# EAGLE board MainAutobike (EAGLE 7.3.0)
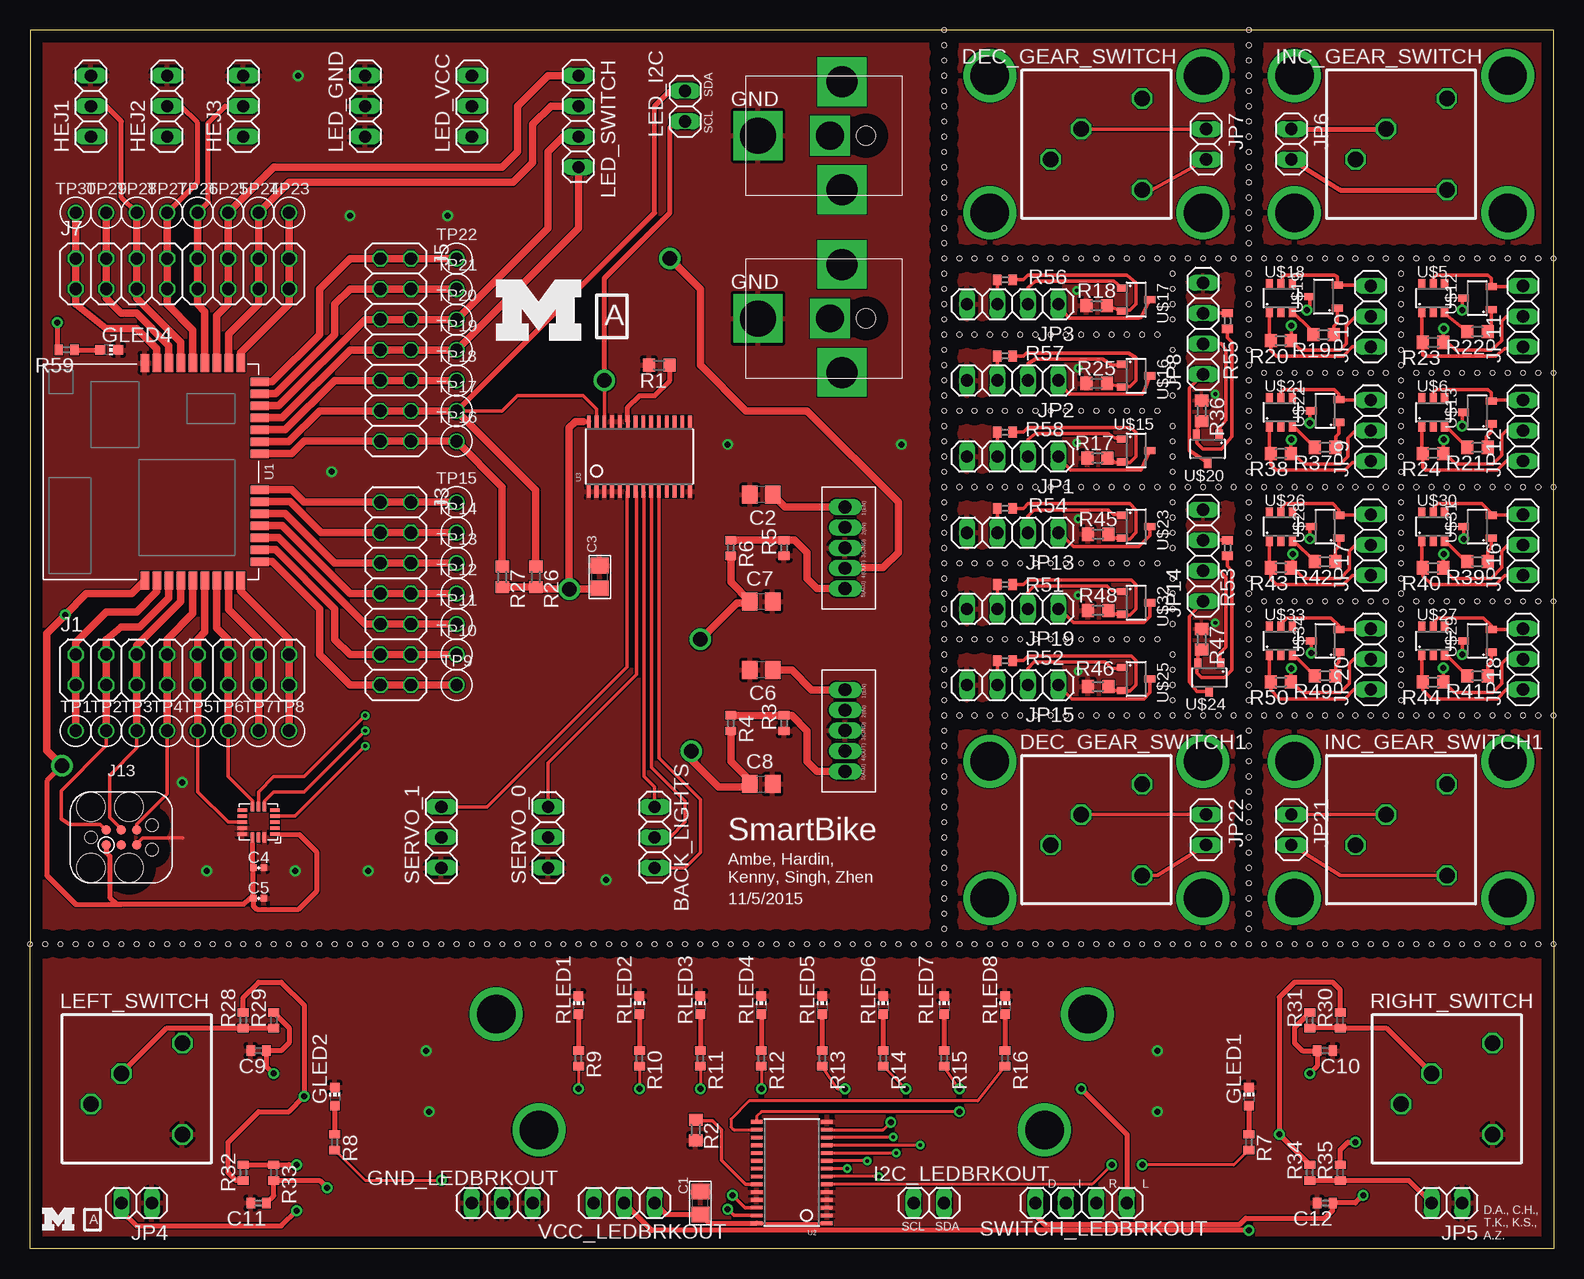
[diagram p6: board, top side]
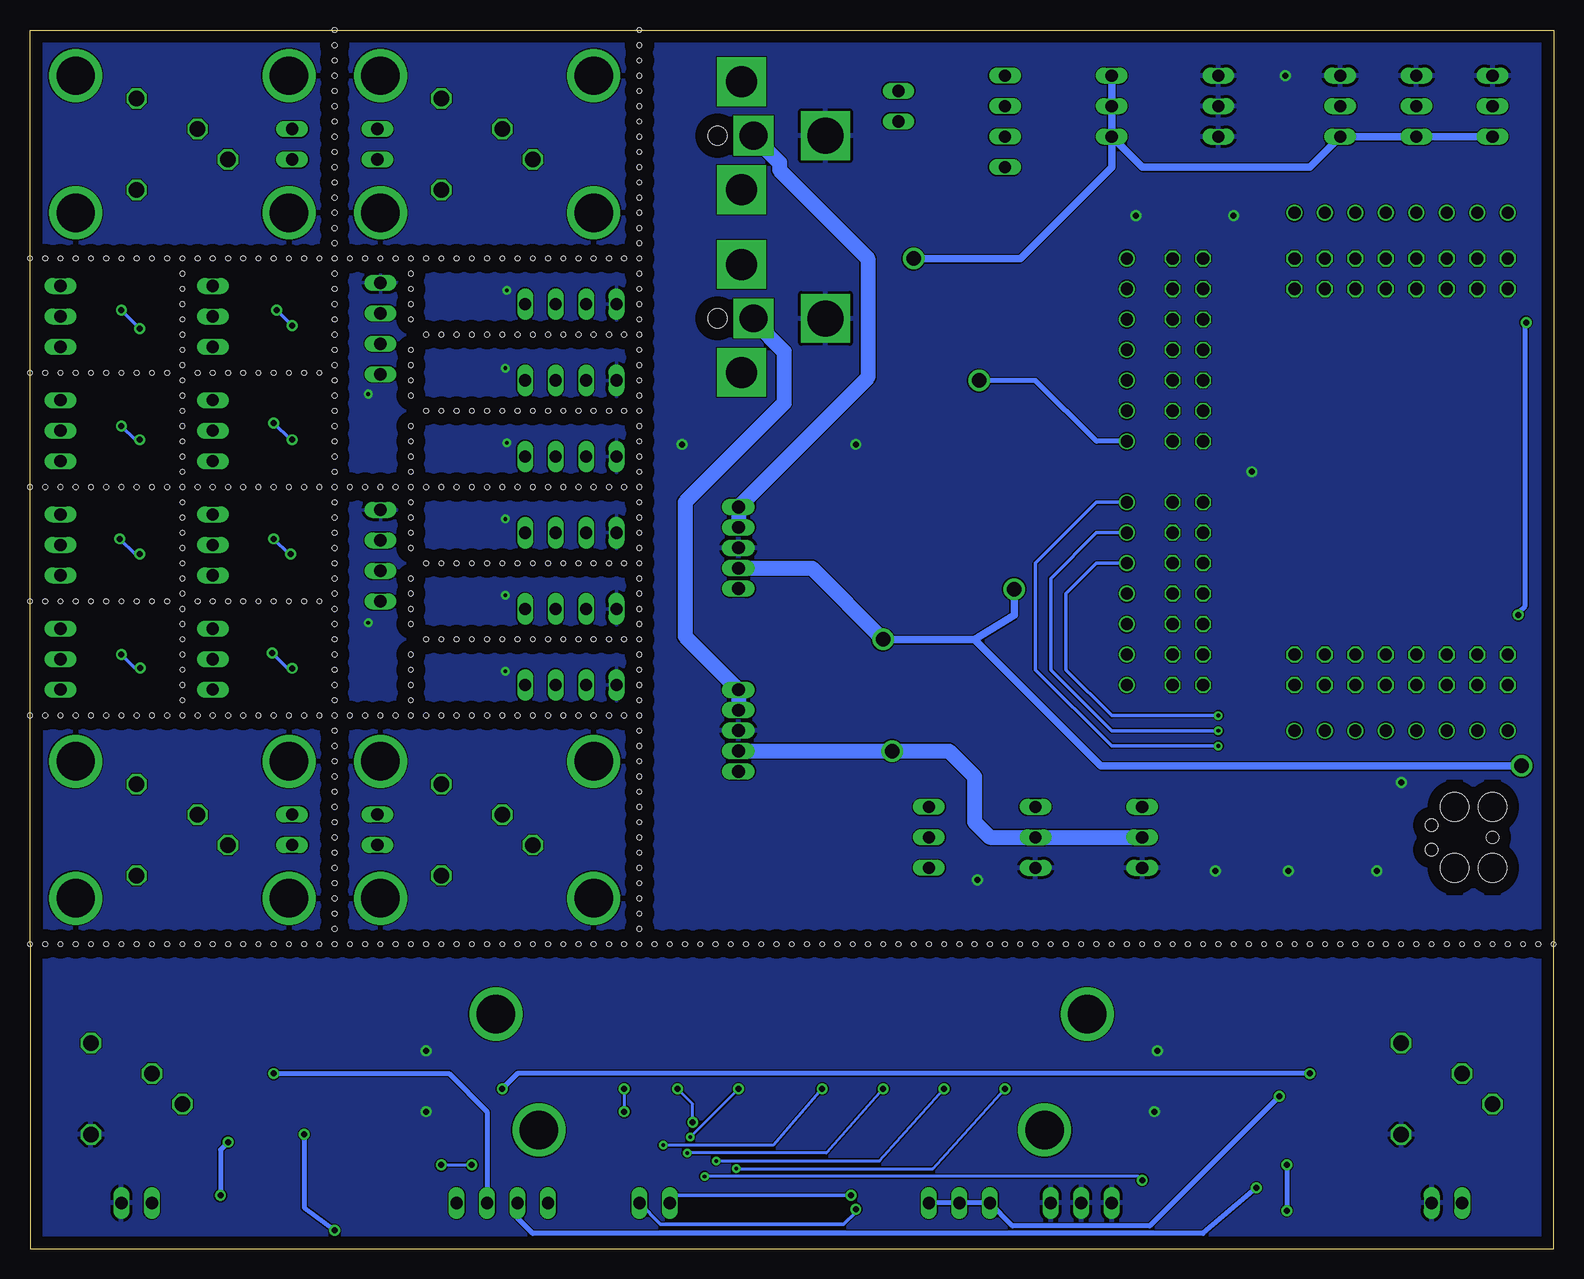
[diagram p7: board, bottom side, seen from below]

Size 127 x 101.6 mm. Coordinates in mm from the lower left corner, seen from the top.
Outline: 101.6,101.6 76.2,101.6 0,101.6 0,25.4 0,0 127,0 127,25.4 127,44.45 127,53.98 127,63.5 127,73.03 127,82.55 127,101.6 101.6,101.6
Copper layers (1*16): Top 0.035mm / dielectric 1.5mm / Bottom 0.035mm
Design rules "default *": minimum track width 4mil, minimum drill 12mil, track to track 4mil, track to pad 4mil, pad to pad 4mil, via to via 4mil, smd to smd 4mil, copper to edge 40mil, drill to drill 8mil, minimum pad ring 6mil, minimum via ring 8mil, stop-mask expansion 4mil, vias tented up to drill 0mil, thermal gap 10mil
Holes 0.38 mm at 0,25.4 1.27,25.4 2.54,25.4 3.81,25.4 5.08,25.4 6.35,25.4 7.62,25.4 8.89,25.4 10.16,25.4 11.43,25.4 12.7,25.4 13.97,25.4 15.24,25.4 16.51,25.4 17.78,25.4 19.05,25.4 20.32,25.4 21.59,25.4 22.86,25.4 24.13,25.4 25.4,25.4 26.67,25.4 27.94,25.4 29.21,25.4 30.48,25.4 31.75,25.4 33.02,25.4 34.29,25.4 35.56,25.4 36.83,25.4 38.1,25.4 39.37,25.4 40.64,25.4 41.91,25.4 43.18,25.4 44.45,25.4 45.72,25.4 46.99,25.4 48.26,25.4 49.53,25.4 50.8,25.4 52.07,25.4 53.34,25.4 54.61,25.4 55.88,25.4 57.15,25.4 58.42,25.4 59.69,25.4 60.96,25.4 62.23,25.4 63.5,25.4 64.77,25.4 66.04,25.4 67.31,25.4 68.58,25.4 69.85,25.4 71.12,25.4 72.39,25.4 73.66,25.4 74.93,25.4 76.2,25.4 77.47,25.4 78.74,25.4 80.01,25.4 81.28,25.4 82.55,25.4 83.82,25.4 85.09,25.4 86.36,25.4 87.63,25.4 88.9,25.4 90.17,25.4 91.44,25.4 92.71,25.4 93.98,25.4 95.25,25.4 96.52,25.4 97.79,25.4 99.06,25.4 100.33,25.4 101.6,25.4 102.87,25.4 104.14,25.4 105.41,25.4 106.68,25.4 107.95,25.4 109.22,25.4 110.49,25.4 111.76,25.4 113.03,25.4 114.3,25.4 115.57,25.4 116.84,25.4 118.11,25.4 119.38,25.4 120.65,25.4 121.92,25.4 123.19,25.4 124.46,25.4 125.73,25.4 127,25.4 76.2,101.6 76.2,100.33 76.2,99.06 76.2,97.79 76.2,96.52 76.2,95.25 76.2,93.98 76.2,92.71 76.2,91.44 76.2,90.17 76.2,88.9 76.2,87.63 76.2,86.36 76.2,85.09 76.2,83.82 76.2,82.55 76.2,81.28 76.2,80.01 76.2,78.74 76.2,77.47 76.2,76.2 76.2,74.93 76.2,73.66 76.2,72.39 76.2,71.12 76.2,69.85 76.2,68.58 76.2,67.31 76.2,66.04 76.2,64.77 76.2,63.5 76.2,62.23 76.2,60.96 76.2,59.69 76.2,58.42 76.2,57.15 76.2,55.88 76.2,54.61 76.2,53.34 76.2,52.07 76.2,50.8 76.2,49.53 76.2,48.26 76.2,46.99 76.2,45.72 76.2,44.45 76.2,43.18 76.2,41.91 76.2,40.64 76.2,39.37 76.2,38.1 76.2,36.83 76.2,35.56 76.2,34.29 76.2,33.02 76.2,31.75 76.2,30.48 76.2,29.21 76.2,27.94 76.2,26.67 101.6,101.6 101.6,100.33 101.6,99.06 101.6,97.79 101.6,96.52 101.6,95.25 101.6,93.98 101.6,92.71 101.6,91.44 101.6,90.17 101.6,88.9 101.6,87.63 101.6,86.36 101.6,85.09 101.6,83.82 101.6,81.28 101.6,80.01 101.6,78.74 101.6,77.47 101.6,76.2 101.6,74.93 101.6,73.66 101.6,72.39 101.6,71.12 101.6,69.85 101.6,68.58 101.6,67.31 101.6,66.04 101.6,64.77 101.6,63.5 101.6,62.23 101.6,60.96 101.6,59.69 101.6,58.42 101.6,57.15 101.6,55.88 101.6,54.61 101.6,53.34 101.6,52.07 101.6,50.8 101.6,49.53 101.6,48.26 101.6,46.99 101.6,45.72 101.6,44.45 101.6,43.18 101.6,41.91 101.6,40.64 101.6,39.37 101.6,38.1 101.6,36.83 101.6,35.56 101.6,34.29 101.6,33.02 101.6,31.75 101.6,30.48 101.6,29.21 101.6,27.94 101.6,26.67 77.47,44.45 78.74,44.45 80.01,44.45 81.28,44.45 82.55,44.45 83.82,44.45 85.09,44.45 86.36,44.45 87.63,44.45 88.9,44.45 90.17,44.45 91.44,44.45 92.71,44.45 93.98,44.45 95.25,44.45 96.52,44.45 97.79,44.45 99.06,44.45 100.33,44.45 102.87,44.45 104.14,44.45 105.41,44.45 106.68,44.45 107.95,44.45 109.22,44.45 110.49,44.45 111.76,44.45 113.03,44.45 114.3,44.45 115.57,44.45 116.84,44.45 118.11,44.45 119.38,44.45 120.65,44.45 121.92,44.45 123.19,44.45 124.46,44.45 125.73,44.45 77.47,63.5 78.74,63.5 80.01,63.5 81.28,63.5 82.55,63.5 83.82,63.5 85.09,63.5 86.36,63.5 87.63,63.5 88.9,63.5 90.17,63.5 91.44,63.5 92.71,63.5 93.98,63.5 95.25,63.5 96.52,63.5 97.79,63.5 99.06,63.5 100.33,63.5 102.87,63.5 104.14,63.5 105.41,63.5 106.68,63.5 107.95,63.5 109.22,63.5 110.49,63.5 111.76,63.5 113.03,63.5 114.3,63.5 115.57,63.5 116.84,63.5 118.11,63.5 119.38,63.5 120.65,63.5 121.92,63.5 123.19,63.5 124.46,63.5 125.73,63.5 101.6,82.55 77.47,82.55 78.74,82.55 80.01,82.55 81.28,82.55 82.55,82.55 83.82,82.55 85.09,82.55 86.36,82.55 87.63,82.55 88.9,82.55 90.17,82.55 91.44,82.55 92.71,82.55 93.98,82.55 95.25,82.55 96.52,82.55 97.79,82.55 99.06,82.55 100.33,82.55 102.87,82.55 104.14,82.55 105.41,82.55 106.68,82.55 107.95,82.55 109.22,82.55 110.49,82.55 111.76,82.55 113.03,82.55 114.3,82.55 115.57,82.55 116.84,82.55 118.11,82.55 119.38,82.55 120.65,82.55 121.92,82.55 123.19,82.55 124.46,82.55 125.73,82.55 77.47,69.85 78.74,69.85 80.01,69.85 81.28,69.85 82.55,69.85 83.82,69.85 85.09,69.85 86.36,69.85 87.63,69.85 88.9,69.85 90.17,69.85 91.44,69.85 92.71,69.85 93.98,69.85 95.25,67.31 95.25,66.04 95.25,64.77 95.25,71.12 95.25,72.39 95.25,73.66 95.25,74.93 95.25,68.58 93.98,76.2 95.25,77.47 95.25,78.74 95.25,80.01 95.25,81.28 77.47,76.2 78.74,76.2 80.01,76.2 81.28,76.2 82.55,76.2 83.82,76.2 85.09,76.2 86.36,76.2 87.63,76.2 88.9,76.2 90.17,76.2 91.44,76.2 92.71,76.2 102.87,73.03 104.14,73.03 105.41,73.03 106.68,73.03 107.95,73.03 109.22,73.03 110.49,73.03 111.76,73.03 113.03,73.03 114.3,81.28 114.3,80.01 114.3,78.74 114.3,77.47 114.3,76.2 114.3,74.93 114.3,73.66 115.57,73.03 116.84,73.03 118.11,73.03 119.38,73.03 120.65,73.03 121.92,73.03 123.19,73.03 124.46,73.03 125.73,73.03 114.3,72.39 114.3,71.12 114.3,69.85 114.3,68.58 114.3,67.31 114.3,66.04 114.3,64.77 114.3,62.23 114.3,60.96 114.3,59.69 114.3,58.42 114.3,57.15 114.3,55.88 114.3,54.61 114.3,53.34 114.3,52.07 114.3,50.8 114.3,49.53 114.3,48.26 114.3,46.99 114.3,45.72 102.87,53.98 104.14,53.98 105.41,53.98 106.68,53.98 107.95,53.98 109.22,53.98 110.49,53.98 111.76,53.98 113.03,53.98 115.57,53.98 116.84,53.98 118.11,53.98 119.38,53.98 120.65,53.98 121.92,53.98 123.19,53.98 124.46,53.98 125.73,53.98 95.25,48.26 95.25,46.99 95.25,45.72 95.25,52.07 95.25,53.34 95.25,54.61 95.25,55.88 95.25,49.53 95.25,58.42 95.25,59.69 95.25,60.96 95.25,62.23 77.47,57.15 78.74,57.15 80.01,57.15 81.28,57.15 82.55,57.15 83.82,57.15 85.09,57.15 86.36,57.15 87.63,57.15 88.9,57.15 90.17,57.15 91.44,57.15 92.71,57.15 93.98,57.15 77.47,50.8 78.74,50.8 80.01,50.8 81.28,50.8 82.55,50.8 83.82,50.8 85.09,50.8 86.36,50.8 87.63,50.8 88.9,50.8 90.17,50.8 91.44,50.8 92.71,50.8 93.98,50.8 127,82.55 127,73.03 127,63.5 127,53.98 127,44.45

## Footprints (pad centres in the part's own frame; a part is rotated, then mirrored left to right if it is on the bottom)
1X03 = drill 1.016 long: 1 -2.54,0; 2 0,0; 3 2.54,0
0805 = smd 1.3 x 1.5: 1 -0.95,0; 2 0.95,0
C0805 = smd 1.3 x 1.5: 1 -0.95,0; 2 0.95,0
0402_CAP = smd 0.536 x 0.546: 1 -0.433,0; 2 0.433,0
C0402 = smd 0.7 x 0.9: 1 -0.65,0; 2 0.65,0
LED_SWITCH = drill 1.3 octagon: P$1 -3.81,-1.27; P$2 -1.27,1.27; P$3 3.81,3.81; P$4 3.81,-3.81
CHIP-LED0603 = smd 0.8 x 0.8: A 0,-0.75; C 0,0.75
1X02 = drill 1.016 long: 1 -1.27,0; 2 1.27,0
2X08 = drill 1.016 octagon: 1 -8.89,-1.27; 2 -8.89,1.27; 3 -6.35,-1.27; 4 -6.35,1.27; 5 -3.81,-1.27; 6 -3.81,1.27; 7 -1.27,-1.27; 8 -1.27,1.27; 9 1.27,-1.27; 10 1.27,1.27; 11 3.81,-1.27; 12 3.81,1.27; 13 6.35,-1.27; 14 6.35,1.27; 15 8.89,-1.27; 16 8.89,1.27
2X07 = drill 1.016 octagon: 1 -7.62,-1.27; 2 -7.62,1.27; 3 -5.08,-1.27; 4 -5.08,1.27; 5 -2.54,-1.27; 6 -2.54,1.27; 7 0,-1.27; 8 0,1.27; 9 2.54,-1.27; 10 2.54,1.27; 11 5.08,-1.27; 12 5.08,1.27; 13 7.62,-1.27; 14 7.62,1.27
TC2030-IDC = smd 0.787 x 0.787: 1 -1.27,-0.635; 2 -1.27,0.635; 3 0,-0.635; 4 0,0.635; 5 1.27,-0.635; 6 1.27,0.635 | hole 2.375: -2.54,2.54; 0.635,2.54; 0.635,-2.54; -2.54,-2.54 | hole 1.016: -2.54,0; 2.54,1.016; 2.54,-1.016
1X04 = drill 1.016 long: 1 -3.81,0; 2 -1.27,0; 3 1.27,0; 4 3.81,0
R0603 = smd 1 x 1.1: 1 -0.85,0; 2 0.85,0
R0402 = smd 0.7 x 0.9: 1 -0.65,0; 2 0.65,0
TESTPOINT_0.040IN = drill 1.016: TESTPOINT 0,0
ATUM = smd 0.7 x 1.5: 1 -9.479,-9.079; 2 -8.479,-9.079; 3 -7.479,-9.079; 4 -6.479,-9.079; 5 -5.479,-9.079; 6 -4.479,-9.079; 7 -3.479,-9.079; 8 -2.479,-9.079; 24 -1.479,9.079; 25 -2.479,9.079; 26 -3.479,9.079; 27 -4.479,9.079; 28 -5.479,9.079; 29 -6.479,9.079; 30 -7.479,9.079; 31 -8.479,9.079; 32 -9.479,9.079 | smd 0.754 x 1.5: 9 -1.479,-9.079 | smd 1.5 x 0.7: 10 0.1,-7.5; 11 0.1,-6.5; 12 0.1,-5.5; 13 0.1,-4.5; 14 0.1,-3.5; 15 0.1,-2.5; 16 0.1,-1.5; 17 0.1,1.5; 18 0.1,2.5; 19 0.1,3.5; 20 0.1,4.5; 21 0.1,5.5; 22 0.1,6.5; 23 0.1,7.5
TSSOP28 = smd 0.305 x 0.991: 1 -4.225,-2.918; 2 -3.575,-2.918; 3 -2.925,-2.918; 4 -2.275,-2.918; 5 -1.625,-2.918; 6 -0.975,-2.918; 7 -0.325,-2.918; 8 0.325,-2.918; 9 0.975,-2.918; 10 1.625,-2.918; 11 2.275,-2.918; 12 2.925,-2.918; 13 3.575,-2.918; 14 4.225,-2.918; 15 4.225,2.918; 16 3.575,2.918; 17 2.925,2.918; 18 2.275,2.918; 19 1.625,2.918; 20 0.975,2.918; 21 0.325,2.918; 22 -0.325,2.918; 23 -0.975,2.918; 24 -1.625,2.918; 25 -2.275,2.918; 26 -2.925,2.918; 27 -3.575,2.918; 28 -4.225,2.918
ADXL362 = smd 0.8 x 0.3: P$1 -1.35,1; P$2 -1.35,0.5; P$3 -1.35,0; P$4 -1.35,-0.5; P$5 -1.35,-1; P$9 1.35,-1; P$10 1.35,-0.5; P$11 1.35,0; P$12 1.35,0.5; P$13 1.35,1 | smd 0.3 x 0.8: P$6 -0.5,-1.275; P$7 0,-1.275; P$8 0.5,-1.275; P$14 0.5,1.275; P$15 0,1.275; P$16 -0.5,1.275
MIC29710 = drill 1.067 pad 1.27 long: 1(EN) 1.664,1.905; 2(IN) 3.365,1.905; 3(GND) 5.067,1.905; 4(OUT) 6.769,1.905; 5(ADJ) 8.471,1.905
SOT23-6 = smd 0.6 x 0.9: 1 -0.95,-1.15; 2 0,-1.15; 3 0.95,-1.15; 4 0.95,1.15; 5 0,1.15; 6 -0.95,1.15
PJ063BH = drill 2.6 pad 4.064 square: FRAME0 0.5,8; FRAME1 9.5,8 | drill 3 pad 4.064 square: GND 5,1 | drill 2.3 pad 3.302 square: VDD 5,7 | hole 1.6: 5,10
SOT23-3 = smd 0.6 x 0.9: 1 -0.95,-1.15; 2 0.95,-1.15; 3 0,1.15

## Placement (x,y rotation side)
BACK_LIGHTS  [1X03]  52.07,34.29 270 top
C1  10uF  [0805]  55.88,3.81 90 top
C2  10uF  [C0805]  60.96,62.87 180 top
C3  10uF  [0805]  47.5,56.01 90 top
C4  100nF  [0402_CAP]  19.05,31.75 0 top
C5  100nF  [0402_CAP]  19.05,29.21 0 top
C6  10uF  [C0805]  60.96,48.26 180 top
C7  33uF  [C0805]  60.96,53.98 0 top
C8  33uF  [C0805]  60.96,38.73 0 top
C9  [C0402]  19.05,16.51 180 top
C10  [C0402]  107.95,16.51 0 top
C11  [C0402]  19.05,3.81 180 top
C12  [C0402]  107.95,3.81 180 top
DEC_GEAR_SWITCH  LED_SWITCH  [LED_SWITCH]  88.9,92.08 0 top
DEC_GEAR_SWITCH1  LED_SWITCH  [LED_SWITCH]  88.9,34.92 0 top
GLED1  [CHIP-LED0603]  101.6,12.7 0 top
GLED2  [CHIP-LED0603]  25.4,12.7 0 top
GLED4  [CHIP-LED0603]  6.6,74.93 270 top
GND_LEDBRKOUT  [1X03]  39.37,3.81 0 top
HEJ1  [1X03]  5.08,95.25 90 top
HEJ2  [1X03]  11.43,95.25 90 top
HEJ3  [1X03]  17.78,95.25 90 top
I2C_LEDBRKOUT  [1X02]  74.93,3.81 0 top
INC_GEAR_SWITCH  LED_SWITCH  [LED_SWITCH]  114.3,92.08 0 top
INC_GEAR_SWITCH1  LED_SWITCH  [LED_SWITCH]  114.3,34.92 0 top
J1  [2X08]  12.7,48.26 0 top
J3  [2X07]  30.48,54.61 270 top
J5  [2X07]  30.48,74.93 270 top
J7  [2X08]  12.7,81.28 0 top
J13  TC2030-CTX  [TC2030-IDC]  7.62,34.29 0 top
JP1  [1X04]  81.91,66.04 180 top
JP2  [1X04]  81.91,72.39 180 top
JP3  [1X04]  81.91,78.74 180 top
JP4  [1X02]  8.89,3.81 180 top
JP5  [1X02]  118.11,3.81 180 top
JP6  [1X02]  105.16,92.08 270 top
JP7  [1X02]  98.04,92.08 270 top
JP8  [1X04]  97.79,76.71 90 top
JP9  [1X03]  111.76,68.2 90 top
JP10  [1X03]  111.76,77.72 90 top
JP11  [1X03]  124.46,77.72 90 top
JP12  [1X03]  124.46,68.2 90 top
JP13  [1X04]  81.91,59.69 180 top
JP14  [1X04]  97.79,57.78 90 top
JP15  [1X04]  81.91,46.99 180 top
JP16  [1X03]  124.46,58.67 90 top
JP17  [1X03]  111.76,58.67 90 top
JP18  [1X03]  124.46,49.15 90 top
JP19  [1X04]  81.91,53.34 180 top
JP20  [1X03]  111.76,49.15 90 top
JP21  [1X02]  105.16,34.92 270 top
JP22  [1X02]  98.04,34.92 270 top
LED_GND  [1X03]  27.94,95.25 90 top
LED_I2C  [1X02]  54.61,95.25 90 top
LED_SWITCH  [1X04]  45.72,93.98 270 top
LED_VCC  [1X03]  36.83,95.25 90 top
LEFT_SWITCH  LED_SWITCH  [LED_SWITCH]  8.89,13.34 0 top
R1  10K  [R0603]  52.45,73.66 180 top
R2  10K  [R0603]  55.5,9.91 270 top
R3  26.1k  [R0402]  62.87,43.81 90 top
R4  100k  [R0402]  58.42,43.81 270 top
R5  60.4k  [R0402]  62.87,58.42 90 top
R6  100k  [R0402]  58.42,58.42 270 top
R7  60.4  [R0402]  101.6,8.89 270 top
R8  60.4  [R0402]  25.4,8.89 270 top
R9  261  [R0402]  45.72,15.88 270 top
R10  261  [R0402]  50.8,15.88 270 top
R11  261  [R0402]  55.88,15.88 270 top
R12  261  [R0402]  60.96,15.88 270 top
R13  261  [R0402]  66.04,15.88 270 top
R14  261  [R0402]  71.12,15.88 270 top
R15  261  [R0402]  76.2,15.88 270 top
R16  261  [R0402]  81.28,15.88 270 top
R17  10k  [R0603]  88.98,65.91 0 top
R18  10k  [R0603]  88.9,78.61 0 top
R19  1k  [R0603]  107.82,76.2 180 top
R20  390  [R0603]  104.27,75.69 180 top
R21  1k  [R0603]  120.65,66.8 180 top
R22  1k  [R0603]  120.65,76.45 180 top
R23  390  [R0603]  116.97,75.56 180 top
R24  390  [R0603]  116.97,66.29 180 top
R25  10k  [R0603]  88.9,72.14 0 top
R26  10k  [R0603]  42.16,56.01 270 top
R27  10k  [R0603]  39.37,56.01 270 top
R28  [R0402]  17.78,19.05 90 top
R29  [R0402]  20.32,19.05 90 top
R30  [R0402]  109.22,19.05 90 top
R31  [R0402]  106.68,19.05 90 top
R32  [R0402]  17.78,6.35 270 top
R33  [R0402]  20.32,6.35 270 top
R34  [R0402]  106.68,6.35 90 top
R35  [R0402]  109.22,6.35 90 top
R36  10k  [R0603]  97.66,69.85 270 top
R37  1k  [R0603]  107.95,66.8 180 top
R38  390  [R0603]  104.27,66.29 180 top
R39  1k  [R0603]  120.65,57.28 180 top
R40  390  [R0603]  116.97,56.77 180 top
R41  1k  [R0603]  120.65,47.75 180 top
R42  1k  [R0603]  107.95,57.28 180 top
R43  390  [R0603]  104.27,56.77 180 top
R44  390  [R0603]  116.97,47.24 180 top
R45  10k  [R0603]  89.03,59.56 0 top
R46  10k  [R0603]  89.03,46.86 0 top
R47  10k  [R0603]  97.66,50.8 270 top
R48  10k  [R0603]  89.03,53.21 0 top
R49  1k  [R0603]  107.95,47.75 180 top
R50  390  [R0603]  104.27,47.24 180 top
R51  33  [R0402]  81.28,55.37 0 top
R52  33  [R0402]  81.28,49.02 0 top
R53  33  [R0402]  99.82,58.42 270 top
R54  33  [R0402]  81.28,61.72 0 top
R55  33  [R0402]  99.82,77.34 270 top
R56  33  [R0402]  81.28,80.77 0 top
R57  33  [R0402]  81.28,74.42 0 top
R58  33  [R0402]  81.28,68.07 0 top
R59  60.4  [R0402]  3.05,74.93 180 top
RIGHT_SWITCH  LED_SWITCH  [LED_SWITCH]  118.11,13.34 0 top
RLED1  [CHIP-LED0603]  45.72,20.32 0 top
RLED2  [CHIP-LED0603]  50.8,20.32 0 top
RLED3  [CHIP-LED0603]  55.88,20.32 0 top
RLED4  [CHIP-LED0603]  60.96,20.32 0 top
RLED5  [CHIP-LED0603]  66.04,20.32 0 top
RLED6  [CHIP-LED0603]  71.12,20.32 0 top
RLED7  [CHIP-LED0603]  76.2,20.32 0 top
RLED8  [CHIP-LED0603]  81.28,20.32 0 top
SERVO_0  [1X03]  43.18,34.29 90 top
SERVO_1  [1X03]  34.29,34.29 90 top
SWITCH_LEDBRKOUT  [1X04]  87.63,3.81 0 top
TP1  TEST_POINT_0.040IN  [TESTPOINT_0.040IN]  3.81,43.18 0 top
TP2  TEST_POINT_0.040IN  [TESTPOINT_0.040IN]  6.35,43.18 0 top
TP3  TEST_POINT_0.040IN  [TESTPOINT_0.040IN]  8.89,43.18 0 top
TP4  TEST_POINT_0.040IN  [TESTPOINT_0.040IN]  11.43,43.18 0 top
TP5  TEST_POINT_0.040IN  [TESTPOINT_0.040IN]  13.97,43.18 0 top
TP6  TEST_POINT_0.040IN  [TESTPOINT_0.040IN]  16.51,43.18 0 top
TP7  TEST_POINT_0.040IN  [TESTPOINT_0.040IN]  19.05,43.18 0 top
TP8  TEST_POINT_0.040IN  [TESTPOINT_0.040IN]  21.59,43.18 0 top
TP9  TEST_POINT_0.040IN  [TESTPOINT_0.040IN]  35.56,46.99 0 top
TP10  TEST_POINT_0.040IN  [TESTPOINT_0.040IN]  35.56,49.53 0 top
TP11  TEST_POINT_0.040IN  [TESTPOINT_0.040IN]  35.56,52.07 0 top
TP12  TEST_POINT_0.040IN  [TESTPOINT_0.040IN]  35.56,54.61 0 top
TP13  TEST_POINT_0.040IN  [TESTPOINT_0.040IN]  35.56,57.15 0 top
TP14  TEST_POINT_0.040IN  [TESTPOINT_0.040IN]  35.56,59.69 0 top
TP15  TEST_POINT_0.040IN  [TESTPOINT_0.040IN]  35.56,62.23 0 top
TP16  TEST_POINT_0.040IN  [TESTPOINT_0.040IN]  35.56,67.31 0 top
TP17  TEST_POINT_0.040IN  [TESTPOINT_0.040IN]  35.56,69.85 0 top
TP18  TEST_POINT_0.040IN  [TESTPOINT_0.040IN]  35.56,72.39 0 top
TP19  TEST_POINT_0.040IN  [TESTPOINT_0.040IN]  35.56,74.93 0 top
TP20  TEST_POINT_0.040IN  [TESTPOINT_0.040IN]  35.56,77.47 0 top
TP21  TEST_POINT_0.040IN  [TESTPOINT_0.040IN]  35.56,80.01 0 top
TP22  TEST_POINT_0.040IN  [TESTPOINT_0.040IN]  35.56,82.55 0 top
TP23  TEST_POINT_0.040IN  [TESTPOINT_0.040IN]  21.59,86.36 0 top
TP24  TEST_POINT_0.040IN  [TESTPOINT_0.040IN]  19.05,86.36 0 top
TP25  TEST_POINT_0.040IN  [TESTPOINT_0.040IN]  16.51,86.36 0 top
TP26  TEST_POINT_0.040IN  [TESTPOINT_0.040IN]  13.97,86.36 0 top
TP27  TEST_POINT_0.040IN  [TESTPOINT_0.040IN]  11.43,86.36 0 top
TP28  TEST_POINT_0.040IN  [TESTPOINT_0.040IN]  8.89,86.36 0 top
TP29  TEST_POINT_0.040IN  [TESTPOINT_0.040IN]  6.35,86.36 0 top
TP30  TEST_POINT_0.040IN  [TESTPOINT_0.040IN]  3.81,86.36 0 top
U1  ATUM  [ATUM]  19.05,64.77 0 top
U2  PCA9685  [TSSOP28]  63.5,6.35 90 top
U3  PCA9685  [TSSOP28]  50.8,66.04 0 top
U4  ADXL362  [ADXL362]  19.05,35.56 180 top
U$1  [UMICH_SOLID_200MIL]  38.86,75.69 0 top
U$2  MIC29710  [MIC29710]  66.04,63.5 270 top
U$3  [UMICH_SOLID_75MIL]  1.02,1.52 0 top
U$4  MIC29710  [MIC29710]  66.04,48.26 270 top
U$5  HALLEFFECT  [SOT23-6]  116.97,79.25 0 top
U$6  HALLEFFECT  [SOT23-6]  116.97,69.72 0 top
U$11  PJ063PH  [PJ063BH]  59.69,97.79 270 top
U$12  25AA02E48-SOT-23-6  [SOT23-3]  120.65,79.25 90 top
U$13  25AA02E48-SOT-23-6  [SOT23-3]  120.65,69.72 90 top
U$14  PJ063PH  [PJ063BH]  59.69,82.55 270 top
U$15  25AA02E48-SOT-23-6  [SOT23-3]  92.2,66.55 270 top
U$16  25AA02E48-SOT-23-6  [SOT23-3]  92.2,72.77 270 top
U$17  25AA02E48-SOT-23-6  [SOT23-3]  92.2,79.12 270 top
U$18  HALLEFFECT  [SOT23-6]  104.27,79.25 0 top
U$19  25AA02E48-SOT-23-6  [SOT23-3]  107.82,79.38 90 top
U$20  25AA02E48-SOT-23-6  [SOT23-3]  98.17,66.67 180 top
U$21  HALLEFFECT  [SOT23-6]  104.27,69.72 0 top
U$22  25AA02E48-SOT-23-6  [SOT23-3]  107.95,69.85 90 top
U$23  25AA02E48-SOT-23-6  [SOT23-3]  92.2,60.2 270 top
U$24  25AA02E48-SOT-23-6  [SOT23-3]  98.3,47.62 180 top
U$25  25AA02E48-SOT-23-6  [SOT23-3]  92.2,47.5 270 top
U$26  HALLEFFECT  [SOT23-6]  104.27,60.2 0 top
U$27  HALLEFFECT  [SOT23-6]  116.97,50.67 0 top
U$28  25AA02E48-SOT-23-6  [SOT23-3]  107.95,60.2 90 top
U$29  25AA02E48-SOT-23-6  [SOT23-3]  120.65,50.67 90 top
U$30  HALLEFFECT  [SOT23-6]  116.97,60.2 0 top
U$31  25AA02E48-SOT-23-6  [SOT23-3]  120.65,60.2 90 top
U$32  25AA02E48-SOT-23-6  [SOT23-3]  92.2,53.85 270 top
U$33  HALLEFFECT  [SOT23-6]  104.27,50.67 0 top
U$34  25AA02E48-SOT-23-6  [SOT23-3]  107.95,50.67 90 top
VCC_LEDBRKOUT  [1X03]  49.53,3.81 0 top

## Tracks (layer width: path | path; a pad name or v marks a point on that pad's centre or on a via)
19
  Top 0.406: R29.1 R28.1 11.41,18.4 LEFT_SWITCH.P$2
20
  Top 0.406: R31.1 R30.1 113.05,18.4 RIGHT_SWITCH.P$2
21  (via drill 0.5)
  Top 0.406: JP4.2 7.62,3.17 8.89,1.91 20.95,1.91 v22.23,3.17 | R32.1 R33.1 21.58,7 v22.23,6.98
  Bottom 0.406: v22.23,6.98 v22.23,3.17
22
  Top 0.406: JP5.2 114.95,5.7 R35.1 109.2,5.72 106.68,5.72 R34.1
!RESET
  Top 0.61: TP29.TESTPOINT J7.4 J7.3 6.35,79.25 7.62,77.98 8.89,77.98 11.57,75.3 U1.30
AIN3
  Top 0.61: LED_SWITCH.2 43.43,95.25 41.91,93.73 41.91,90.55 40.26,88.9 21.59,88.9 TP24.TESTPOINT J7.14 J7.13 19.05,78.74 16.57,76.26 U1.25
AIN4
  Top 0.61: LED_SWITCH.1 43.18,97.79 40.64,95.25 40.64,91.44 39.37,90.17 20.32,90.17 TP25.TESTPOINT J7.12 J7.11 16.51,78.74 15.57,77.8 U1.26
AIN5
  Top 0.406: TP26.TESTPOINT 14.86,87.25 14.86,93.85 16.26,95.25 HEJ3.2
  Top 0.61: U1.27 14.57,78.14 13.97,78.74 J7.9 J7.10 TP26.TESTPOINT
AIN6
  Top 0.406: HEJ2.2 12.57,95.25 13.97,93.85 13.97,88.9 TP27.TESTPOINT
  Top 0.61: U1.28 13.57,76.6 11.43,78.74 J7.7 J7.8 TP27.TESTPOINT
AIN7
  Top 0.406: TP28.TESTPOINT 7.62,87.63 7.62,93.98 6.35,95.25 HEJ1.2
  Top 0.61: U1.29 12.57,75.57 8.89,79.25 J7.5 J7.6 TP28.TESTPOINT
BATTERY
  Top 0.61: U1.31 10.57,75.03 8.89,76.71 6.35,76.71 3.81,78.74 J7.1 J7.2 TP30.TESTPOINT
BOOTLOADER_CTRL
  Top 0.61: U1.24 17.57,74.72 21.59,78.74 J7.15 J7.16 TP23.TESTPOINT
BOOTLOADER_RX
  Top 0.61: U1.22 20.47,71.27 25.4,76.2 25.4,78.74 26.67,80.01 J5.3 J5.4 TP21.TESTPOINT
BOOTLOADER_TX
  Top 0.61: U1.23 20.2,72.27 24.13,76.2 24.13,80.01 26.67,82.55 J5.1 J5.2 TP22.TESTPOINT
DEC_GEAR_SWITCH_OUT  (via drill 0.5)
  Top 0.406: R35.2 109.22,8.26 109.85,8.89 v110.49,8.89 | v111.12,4.45 110.49,3.81 C12.1 108.6,3.19 107.95,2.54 101.35,2.54 100.84,2.03 84.58,2.03 83.82,2.79 SWITCH_LEDBRKOUT.1
  Bottom 0.406: v110.49,8.89 111.12,8.26 v111.12,4.45
DGND_USB
  Top 0.61: U1.10 20.2,57.27 24.13,53.34 24.13,49.53 26.67,46.99 J3.13 J3.14 TP9.TESTPOINT
DVDD_USB
  Top 0.61: U1.13 21.01,60.27 26.67,54.61 J3.7 J3.8 TP12.TESTPOINT
GND  (via drill 0.5)
  Top 0.305: J13.5 8.89,33.76 9.4,34.27 12.73,34.27
  other vias: 12.7,38.86 14.73,31.5 28.19,31.5 48.01,30.73 58.17,67.06 72.64,67.06 26.67,86.11 34.8,86.11 22.35,97.79 25.15,64.77 22.1,31.5
  pour Bottom: 0,101.6 74.93,101.6 74.93,26.67 0,26.67
  pour Top: 0,101.6 74.93,101.6 74.93,26.67 0,26.67
GND_LEDBRKOUT  (via drill 0.5)
  other vias: 33.02,16.51 33.27,11.43 93.98,16.51 93.98,11.43
  pour Bottom: 0,24.13 127,24.13 127,0 0,0
  pour Top: 0,24.13 127,24.13 127,0 0,0
GND_LGT1  (via drill 0.3)
  other vias: 87.25,67.18
  pour Top: 76.71,69.34 94.49,69.34 94.49,64.14 76.71,64.14
  pour Bottom: 76.71,69.34 94.49,69.34 94.49,64.14 76.71,64.14
GND_LGT2  (via drill 0.3)
  other vias: 87.38,73.41
  pour Bottom: 76.71,75.56 94.49,75.56 94.49,70.36 76.71,70.36
  pour Top: 76.71,75.56 94.49,75.56 94.49,70.36 76.71,70.36
GND_LGT3  (via drill 0.3)
  other vias: 87.25,79.88
  pour Bottom: 76.71,81.91 94.49,81.91 94.49,76.96 76.71,76.96
  pour Top: 76.71,81.91 94.49,81.91 94.49,76.96 76.71,76.96
GND_LGT4  (via drill 0.3)
  other vias: 98.81,71.25
  pour Bottom: 95.63,82.17 100.97,82.17 100.97,64.26 95.63,64.26
  pour Top: 95.63,82.17 100.97,82.17 100.97,64.26 95.63,64.26
GND_LGT5  (via drill 0.3)
  other vias: 87.38,60.83
  pour Top: 76.71,62.99 94.49,62.99 94.49,57.78 76.71,57.78
  pour Bottom: 76.71,62.99 94.49,62.99 94.49,57.78 76.71,57.78
GND_LGT6  (via drill 0.3)
  other vias: 98.81,52.2
  pour Bottom: 95.63,62.87 100.97,62.87 100.97,44.96 95.63,44.96
  pour Top: 95.63,62.87 100.97,62.87 100.97,44.96 95.63,44.96
GND_LGT7  (via drill 0.3)
  other vias: 87.38,48.13
  pour Top: 76.71,50.29 94.49,50.29 94.49,45.09 76.71,45.09
  pour Bottom: 76.71,50.29 94.49,50.29 94.49,45.09 76.71,45.09
GND_LGT8  (via drill 0.3)
  other vias: 87.38,54.48
  pour Top: 76.71,56.64 94.49,56.64 94.49,51.44 76.71,51.44
  pour Bottom: 76.71,56.64 94.49,56.64 94.49,51.44 76.71,51.44
HE1GND
  Top 0.305: JP10.3 111.7,80.33 U$19.2 108.97,81.02 108.71,81.15 104.65,81.15 104.39,81.03 104.39,80.53 U$18.5
HE1OUT  (via drill 0.5)
  Top 0.305: JP10.2 110.49,77.72 109.73,76.96 109.73,75.44 109.22,74.93 105.92,74.93 105.16,75.69 R20.1 105.16,75.73 v105.16,76.96 | U$19.3 106.67,78.48 v106.43,78.23
  Bottom 0.305: v106.43,78.23 v105.16,76.96
HE1VIN
  Top 0.305: U$18.1 103.32,75.79 R20.2 103.42,74.89 103.89,74.42 109.47,74.42 110.24,75.18 JP10.1
HE2GND
  Top 0.305: U$5.5 116.97,80.9 117.22,81.15 121.54,81.15 121.79,80.9 U$12.2 124.39,80.2 JP11.3
HE2OUT  (via drill 0.5)
  Top 0.305: JP11.2 123.06,77.72 122.68,77.34 122.68,75.69 121.79,74.93 118.87,74.93 118.11,75.56 R23.1 117.82,76.67 v117.86,76.71 | v119.38,78.23 119.38,79.13 U$12.3
  Bottom 0.305: v117.86,76.71 v119.38,78.23
HE2VIN
  Top 0.305: U$5.1 116.02,75.66 R23.2 116.12,74.51 116.33,74.42 122.17,74.42 122.94,75.06 124.33,75.06 JP11.1
HE3GND
  Top 0.305: JP12.3 121.87,70.74 U$13.2 121.8,71.37 121.54,71.63 117.22,71.63 116.97,71.37 U$6.5
HE3OUT  (via drill 0.5)
  Top 0.305: JP12.2 123.06,68.2 122.68,67.82 122.68,66.17 121.92,65.41 118.87,65.41 117.98,66.29 R24.1 117.82,67.4 v117.86,67.44 | v119.38,68.58 119.38,69.6 U$13.3
  Bottom 0.305: v117.86,67.44 118.24,67.44 v119.38,68.58
HE3VIN
  Top 0.305: U$6.1 116.02,66.39 R24.2 116.12,65.11 116.33,64.9 122.3,64.9 123.06,65.66 JP12.1
HE4GND
  Top 0.305: JP9.3 109.16,70.74 U$22.2 109.1,71.24 108.71,71.63 104.52,71.63 104.27,71.37 U$21.5
HE4OUT  (via drill 0.5)
  Top 0.305: JP9.2 111.63,68.07 110.36,68.07 109.85,67.56 109.85,66.04 109.22,65.41 106.17,65.41 105.28,66.29 R38.1 105.12,67.4 v105.16,67.44 | v106.68,68.83 106.68,69.73 U$22.3
  Bottom 0.305: v105.16,67.44 105.28,67.44 v106.68,68.83
HE4VIN
  Top 0.305: U$21.1 103.32,66.39 R38.2 103.42,65.37 103.89,64.9 109.6,64.9 110.24,65.53 111.63,65.53 JP9.1
HE5GND
  Top 0.305: JP16.3 124.39,61.15 U$31.2 121.8,61.33 121.03,62.1 117.35,62.1 116.97,61.72 U$30.5
HE5OUT  (via drill 0.5)
  Top 0.305: JP16.2 123.19,58.67 122.68,58.17 122.68,56.77 121.79,55.88 118.62,55.88 117.82,56.68 R40.1 117.82,57.87 v117.86,57.91 | U$31.3 v119.5,59.19 v119.51,59.18
  Bottom 0.305: v119.51,59.18 118.24,57.91 v117.86,57.91
HE5VIN
  Top 0.305: U$30.1 116.02,56.87 R40.2 116.12,56.09 116.84,55.37 122.17,55.37 122.94,56.13 JP16.1
HE6GND
  Top 0.305: U$26.5 104.27,61.72 104.65,62.1 108.59,62.1 109.1,61.59 U$28.2 111.69,61.15 JP17.3
HE6OUT  (via drill 0.5)
  Top 0.305: R43.1 105.28,56.77 | 105.28,56.77 106.17,55.88 109.22,55.88 109.98,56.64 109.98,58.17 110.49,58.67 JP17.2 | 105.28,56.77 v105.28,57.91 | v106.68,59.18 106.68,60.08 U$28.3
  Bottom 0.305: v105.28,57.91 105.41,57.91 v106.68,59.18
HE6VIN
  Top 0.305: U$26.1 103.32,56.87 R43.2 103.42,55.84 103.89,55.37 109.47,55.37 110.24,56.13 JP17.1
HE7GND
  Top 0.305: JP18.3 124.39,51.62 U$29.2 121.8,51.94 121.16,52.58 117.35,52.58 116.97,52.2 U$27.5
HE7OUT  (via drill 0.5)
  Top 0.305: JP18.2 123.06,49.15 122.68,48.77 122.68,47.12 121.92,46.36 118.75,46.36 117.86,47.24 R44.1 117.82,48.22 v117.81,48.41 | v119.38,49.53 119.38,50.55 U$29.3
  Bottom 0.305: v117.81,48.41 118.26,48.41 v119.38,49.53
HE7VIN
  Top 0.305: U$27.1 116.02,47.34 R44.2 116.12,46.57 116.84,45.85 122.3,45.85 123.06,46.61 JP18.1
HE8GND
  Top 0.305: JP20.3 111.69,51.62 U$34.2 109.1,51.94 108.46,52.58 104.78,52.58 104.39,52.2 104.39,51.82 U$33.5
HE8OUT  (via drill 0.5)
  Top 0.305: JP20.2 110.36,49.15 109.98,48.77 109.98,47.12 109.22,46.36 106.05,46.36 105.16,47.24 R50.1 105.12,48.35 v105.16,48.39 | U$34.3 v106.8,49.66 v106.81,49.66
  Bottom 0.305: v106.81,49.66 105.54,48.39 v105.16,48.39
HE8VIN
  Top 0.305: U$33.1 103.32,47.34 R50.2 103.42,46.57 104.14,45.85 109.6,45.85 110.36,46.61 JP20.1
I2C_SCL  (via drill 1.2)
  Top 0.305: v47.88,72.39 U3.26
  Top 0.406: v47.88,72.39 47.88,80.9 53.34,86.36 53.34,93.47 53.85,93.98 LED_I2C.1
  Top 0.61: U1.17 21.82,66.27 22.86,67.31 J5.13 J5.14 TP16.TESTPOINT 39.37,63.5 R27.1
  Bottom 0.406: TP16.TESTPOINT 38.1,67.31 43.18,72.39 v47.88,72.39
I2C_SCL_LEDBRKOUT  (via drill 0.5)
  Top 0.305: v58.55,4.45 59.05,3.96 59.61,3.4 60.56,3.4 U2.26
  Bottom 0.305: I2C_LEDBRKOUT.1 73.03,4.45 v58.55,4.45
I2C_SDA
  Top 0.305: U3.27 47.24,68.98 47.24,69.98 46.1,71.12 40.64,71.12 39.37,69.85 TP17.TESTPOINT
  Top 0.406: TP17.TESTPOINT 52.07,86.36 52.07,95.25 53.34,96.52 LED_I2C.2
  Top 0.61: U1.18 21.55,67.27 24.13,69.85 J5.11 J5.12 TP17.TESTPOINT 42.16,63.25 R26.1
I2C_SDA_LEDBRKOUT  (via drill 0.5)
  Top 0.305: v58.17,3.3 58.69,2.77 U2.27
  Bottom 0.305: I2C_LEDBRKOUT.2 74.42,2.03 59.18,2.03 58.17,3.05 v58.17,3.3
INC_GEAR_SWITCH_OUT  (via drill 0.5)
  Top 0.406: C11.1 20.32,4.43 R33.2 24.15,5.7 v24.77,5.08
  Bottom 0.406: v24.77,5.08 29.21,1.27 85.09,1.27 86.36,2.54 SWITCH_LEDBRKOUT.2
LEFT_SWITCH_OUT  (via drill 0.5)
  Top 0.406: R29.2 21.59,18.43 21.59,17.15 20.95,16.51 C9.1 19.7,15.23 v20.32,14.6 | v87.63,13.34 91.44,9.52 SWITCH_LEDBRKOUT.4
  Bottom 0.406: v20.32,14.6 86.36,14.6 v87.63,13.34
N$1
  Top 0.406: RLED8.A R16.1
N$2
  Top 0.61: R6.1 R5.2 63.74,59.07 64.77,58.04 64.77,55.88 65.62,55.03 U$2.5(ADJ)
N$3
  Top 0.61: R4.1 R3.2 62.88,44.45 63.5,44.45 64.77,43.18 64.77,40.64 65.62,39.79 U$4.5(ADJ)
N$4
  Top 0.406: RLED7.A R15.1
N$5
  Top 0.406: RLED6.A R14.1
N$6
  Top 0.406: RLED5.A R13.1
N$7
  Top 0.406: RLED4.A R12.1
N$8
  Top 0.406: RLED3.A R11.1
N$9
  Top 0.406: RLED2.A R10.1
N$10
  Top 0.406: RLED1.A R9.1
N$11
  Top 0.406: GLED2.A R8.1
N$12
  Top 0.406: GLED1.A R7.1
N$13
  Top 0.305: U$22.1 109.1,67.95 108.84,67.69 108.84,66.84 R37.1
N$14
  Top 0.305: U$21.3 105.33,68.57 R37.2
N$15
  Top 0.305: R19.1 108.67,76.92 108.97,77.22 108.97,78.42 U$19.1
N$16
  Top 0.305: U$18.3 105.29,78.1 106.68,76.71 106.68,76.49 R19.2
N$17
  Top 0.305: U$31.1 121.8,58.43 121.54,58.17 121.54,57.32 R39.1
N$18
  Top 0.305: U$13.1 121.8,68.08 121.41,67.69 121.41,66.89 R21.1
N$19
  Top 0.305: U$30.3 119.69,57.28 R39.2
N$20
  Top 0.305: U$29.1 121.8,48.9 121.54,48.64 121.54,47.79 R41.1
N$21
  Top 0.305: U$6.3 118.03,68.57 R21.2
N$22
  Top 0.305: U$27.3 118.03,49.52 R41.2
N$23
  Top 0.305: R42.1 108.8,58.25 109.09,58.55 U$28.1
N$24
  Top 0.305: U$12.1 121.8,76.63 R22.1
N$25
  Top 0.305: U$5.3 117.92,77.96 R22.2
N$26
  Top 0.305: U$26.3 105.33,59.05 R42.2
N$27
  Top 0.305: U$34.1 109.1,48.9 108.84,48.64 108.84,47.79 R49.1
N$28
  Top 0.305: U$33.3 105.33,49.52 R49.2
N$29
  Top 0.305: R51.1 80.63,53.36 JP19.3
N$30
  Top 0.305: R52.1 80.63,47 JP15.3
N$31
  Top 0.305: R53.1 97.81,59.07 JP14.3
N$32
  Top 0.305: R54.1 80.63,59.7 JP13.3
N$33
  Top 0.305: R55.1 97.81,77.99 JP8.3
N$34
  Top 0.305: R56.1 80.63,78.75 JP3.3
N$35
  Top 0.406: JP6.2 109.22,88.27 INC_GEAR_SWITCH.P$4
N$36
  Top 0.406: JP6.1 INC_GEAR_SWITCH.P$2
N$37
  Top 0.305: JP7.2 93.47,88.27 DEC_GEAR_SWITCH.P$4
N$38
  Top 0.305: DEC_GEAR_SWITCH.P$2 JP7.1
N$39
  Top 0.305: R57.1 80.63,72.41 JP2.3
N$40
  pour Bottom: 77.47,100.33 100.33,100.33 100.33,83.82 77.47,83.82
N$41
  pour Top: 77.47,100.33 100.33,100.33 100.33,83.82 77.47,83.82
N$42
  Top 0.305: R58.1 80.63,66.06 JP1.3
N$43
  Top 0.305: JP21.2 109.22,31.12 INC_GEAR_SWITCH1.P$4
N$44
  Top 0.305: JP21.1 INC_GEAR_SWITCH1.P$2
N$45
  Top 0.305: JP22.2 93.98,31.12 DEC_GEAR_SWITCH1.P$4
N$46
  pour Top: 77.47,43.18 100.33,43.18 100.33,26.67 77.47,26.67
N$47
  pour Bottom: 77.47,43.18 100.33,43.18 100.33,26.67 77.47,26.67
N$48
  pour Bottom: 102.87,43.18 125.73,43.18 125.73,26.67 102.87,26.67
N$49
  Top 0.305: JP22.1 DEC_GEAR_SWITCH1.P$2
N$52  (via drill 3.2 pad 0.61)
  other vias: 38.86,19.56
N$53
  pour Bottom: 102.62,100.58 125.98,100.58 125.98,83.57 102.62,83.57
N$54
  pour Top: 102.62,100.58 125.98,100.58 125.98,83.57 102.62,83.57
N$55
  pour Top: 102.87,43.18 125.73,43.18 125.73,26.67 102.87,26.67
N$57  (via drill 3.2 pad 0.61)
  other vias: 84.58,9.91
N$58  (via drill 3.2 pad 0.61)
  other vias: 88.15,19.56
N$59  (via drill 3.2 pad 0.61)
  other vias: 42.42,9.91
N$62  (via drill 3.2 pad 0.61)
  other vias: 97.79,40.64
N$63  (via drill 3.2 pad 0.61)
  other vias: 97.79,29.21
N$64  (via drill 3.2 pad 0.61)
  other vias: 80.01,29.21
N$65  (via drill 3.2 pad 0.61)
  other vias: 80.01,40.64
N$66  (via drill 3.2 pad 0.61)
  other vias: 105.41,40.64
N$67  (via drill 3.2 pad 0.61)
  other vias: 105.41,29.21
N$69  (via drill 3.2 pad 0.61)
  other vias: 123.19,29.21
N$70  (via drill 3.2 pad 0.61)
  other vias: 123.19,40.64
N$71  (via drill 3.2 pad 0.61)
  other vias: 80.01,86.36
N$72  (via drill 3.2 pad 0.61)
  other vias: 80.01,97.79
N$73  (via drill 3.2 pad 0.61)
  other vias: 97.79,97.79
N$74  (via drill 3.2 pad 0.61)
  other vias: 97.79,86.36
N$75  (via drill 3.2 pad 0.61)
  other vias: 105.41,86.36
N$76  (via drill 3.2 pad 0.61)
  other vias: 105.41,97.79
N$77  (via drill 3.2 pad 0.61)
  other vias: 123.19,97.79
N$78  (via drill 3.2 pad 0.61)
  other vias: 123.19,86.36
N$79
  Top 0.406: R59.1 GLED4.A
OE
  Top 0.406: U3.23 49.83,70.14 50.8,71.12 52.07,71.12 53.34,72.39 53.34,73.62 R1.1
OE_LEDBRKOUT
  Top 0.305: U2.23 59.65,5.38 57.66,7.37 57.66,9.91 56.9,10.67 55.61,10.67 R2.1
OUT_LGT1
  Top 0.305: 89.57,66.13 R17.2 89.85,65.79 90.17,65.79 90.42,65.53 90.99,65.53 U$15.2 91.12,65.53 91.69,65.53 92.2,66.04 92.2,68.07 91.69,68.45 83.19,68.45 82.8,68.07 R58.2
OUT_LGT2
  Top 0.305: R25.2 U$16.2 91.11,71.88 91.69,71.88 92.2,72.39 92.2,74.3 91.57,74.68 83.06,74.68 82.8,74.42 R57.2
OUT_LGT3
  Top 0.305: R18.2 U$17.2 91.11,78.23 91.69,78.23 92.2,78.74 92.2,80.52 91.44,81.15 83.19,81.15 82.8,80.77 R56.2
OUT_LGT4
  Top 0.305: R36.2 97.41,68.78 U$20.2 97.28,67.76 97.28,67.18 97.79,66.67 99.31,66.67 100.2,67.69 100.2,75.56 99.82,75.95 R55.2 99.82,76.45
OUT_LGT5
  Top 0.305: R45.2 90.19,59.25 U$23.2 91.12,59.18 91.69,59.18 92.2,59.69 92.2,61.59 91.69,62.1 83.19,62.1 82.8,61.72 R54.2
OUT_LGT6
  Top 0.305: R47.2 97.35,49.63 U$24.2 97.28,48.71 97.28,48.01 97.66,47.62 99.57,47.62 100.2,48.26 100.2,56.52 99.82,56.9 R53.2
OUT_LGT7
  Top 0.305: R46.2 90.19,46.55 U$25.2 91.12,46.48 91.69,46.48 92.2,46.99 92.2,49.02 91.82,49.4 83.19,49.4 82.8,49.02 R52.2
OUT_LGT8
  Top 0.305: R48.2 90.19,52.9 U$32.2 91.12,52.83 91.69,52.83 92.2,53.34 92.2,55.37 91.82,55.75 83.19,55.75 82.8,55.37 R51.2
P08
  Top 0.61: TP18.TESTPOINT J5.10 J5.9 25.4,72.39 21.28,68.27 U1.19
P09
  Top 0.61: LED_SWITCH.4 45.72,85.09 TP19.TESTPOINT J5.8 J5.7 26.67,74.93 21.01,69.27 U1.20
P10
  Top 0.61: U1.21 20.74,70.27 27.94,77.47 J5.5 J5.6 TP20.TESTPOINT 43.18,85.09 43.18,91.44 44.45,92.71 LED_SWITCH.3
P17
  Top 0.61: TP1.TESTPOINT J1.1 J1.2 3.81,50.55 6.35,53.09 8.89,53.09 10.57,54.77 U1.2
P21
  Top 0.305: U4.P$11 16.51,35.56 13.97,38.1 TP5.TESTPOINT
  Top 0.61: U1.6 14.57,51.4 13.97,50.8 J1.10 J1.9 TP5.TESTPOINT
P22
  Top 0.305: U4.P$8 18.55,37.33 16.51,39.37 TP6.TESTPOINT
  Top 0.61: U1.7 15.57,51.74 16.51,50.8 J1.12 | J1.12 J1.11 | J1.12 TP6.TESTPOINT
P23
  Top 0.61: TP7.TESTPOINT J1.13 J1.14 19.05,50.8 16.57,53.28 U1.8
P24
  Top 0.61: TP8.TESTPOINT J1.15 J1.16 21.59,50.8 17.57,54.82 U1.9
PWM0
  Top 0.305: SERVO_1.3 38.1,36.83 49.78,48.51 49.78,63.08 U3.6
PWM0_0  (via drill 0.5)
  Top 0.254: R7.2 100.34,6.98 v92.71,6.98 | v90.17,6.98 88.56,5.38 U2.6
  Bottom 0.254: v92.71,6.98 v90.17,6.98
PWM1
  Top 0.305: SERVO_0.3 43.18,40.51 50.55,47.88 50.55,63.05 U3.7
PWM1_0  (via drill 0.3, 0.5)
  Top 0.254: R8.2 27.92,5.72 v34.29,5.72 | v70.76,6.02 U2.7
  Bottom 0.254: v34.29,5.72 34.59,6.02 v70.76,6.02
PWM2
  Top 0.305: BACK_LIGHTS.1 52.07,38.48 51.18,39.37 51.18,63.07 U3.8
PWM2_0  (via drill 0.3, 0.5)
  Top 0.254: R9.2 v45.72,13.34 | v68.12,6.68 v68.12,6.67 U2.8
  Bottom 0.254: v68.12,6.68 51.74,6.68 v45.72,13.34
PWM3
  Top 0.305: U3.9 51.82,63.08 51.82,40.13 54.61,37.34 54.61,35.56 53.34,34.29 BACK_LIGHTS.2
PWM3_0  (via drill 0.3, 0.5)
  Top 0.254: R10.2 v50.8,13.34 | v69.8,7.31 69.79,7.33 U2.9
  Bottom 0.254: v69.8,7.31 56.19,7.31 v50.8,13.34
PWM4
  Top 0.305: BACK_LIGHTS.3 54.61,31.75 55.88,33.02 55.88,37.47 52.45,40.89 52.45,63.1 U3.10
PWM4_0  (via drill 0.3, 0.5)
  Top 0.254: R11.2 v55.88,13.34 | v72.21,7.98 U2.10
  Bottom 0.254: v55.88,13.34 60.6,7.98 v72.21,7.98
PWM5_0  (via drill 0.3, 0.5)
  Top 0.254: R12.2 v60.96,13.34 | v74.22,8.64 74.21,8.62 U2.11
  Bottom 0.254: v60.96,13.34 65.02,8.64 v74.22,8.64
PWM6_0  (via drill 0.3, 0.5)
  Top 0.254: R13.2 67.3,13.34 v67.94,13.34 | v71.96,9.32 71.91,9.27 U2.12
  Bottom 0.254: v67.94,13.34 v71.96,9.32
PWM7_0  (via drill 0.5)
  Top 0.254: U2.13 71.14,9.92 v71.75,10.54 | v73.03,13.34 71.77,14.59 R14.2
  Bottom 0.254: v71.75,10.54 71.75,12.06 v73.03,13.34
PWM8_0  (via drill 0.5)
  Top 0.254: R15.2 77.45,13.34 v77.47,13.34 | v77.47,11.43 60.96,11.43 60.58,11.05 U2.15
  Bottom 0.254: v77.47,13.34 v77.47,11.43
PWM9_0
  Top 0.254: R16.2 79.01,12.32 59.94,12.32 58.42,10.8 58.42,10.16 58.66,9.92 U2.16
RIGHT_SWITCH_OUT  (via drill 0.5)
  Top 0.406: R31.2 105.41,18.43 105.41,17.15 106.05,16.51 C10.1 107.3,15.23 v106.68,14.6
  Bottom 0.406: v106.68,14.6 92.08,14.6 88.9,11.43 SWITCH_LEDBRKOUT.3
SIG_LGT1
  Top 0.305: JP1.2 83.19,67.44 83.82,67.94 89.92,67.94 90.42,67.56 90.99,67.56 U$15.1
SIG_LGT2
  Top 0.305: JP2.2 83.19,73.79 83.82,74.17 89.41,74.17 90.17,73.66 90.99,73.66 U$16.1
SIG_LGT3
  Top 0.305: JP3.2 83.19,80.14 83.82,80.64 90.35,80.64 U$17.1
SIG_LGT4
  Top 0.305: JP8.2 99.31,75.44 99.69,74.93 99.69,69.09 99.19,68.45 99.19,67.89 U$20.1
SIG_LGT5
  Top 0.305: JP13.2 83.19,61.09 83.69,61.59 89.92,61.59 90.3,61.21 90.99,61.21 U$23.1
SIG_LGT6
  Top 0.305: JP14.2 99.19,56.52 99.69,56.01 99.69,50.16 99.19,49.66 99.19,48.84 U$24.1
SIG_LGT7
  Top 0.305: JP15.2 83.19,48.39 83.69,48.89 89.66,48.89 90.17,48.39 90.99,48.39 U$25.1
SIG_LGT8
  Top 0.305: JP19.2 83.19,54.74 83.69,55.24 89.79,55.24 90.17,54.86 90.99,54.86 U$32.1
SPI_MISO  (via drill 0.3)
  Top 0.305: U4.P$7 19.05,38.1 20.32,39.37 22.86,39.37 v27.94,44.45
  Top 0.61: U1.14 21.28,61.27 25.4,57.15 J3.5 J3.6 TP13.TESTPOINT
  Bottom 0.305: v27.94,44.45 36.83,44.45 40.64,48.26 40.64,54.61 38.1,57.15 TP13.TESTPOINT
SPI_MOSI  (via drill 0.3)
  Top 0.305: U4.P$6 19.55,37.33 20.32,38.1 22.86,38.1 v27.94,43.18
  Top 0.61: TP14.TESTPOINT J3.4 J3.3 24.26,59.69 21.68,62.27 U1.15
  Bottom 0.305: v27.94,43.18 36.83,43.18 41.91,48.26 41.91,55.88 38.1,59.69 TP14.TESTPOINT
SPI_SCK  (via drill 0.3)
  Top 0.305: U4.P$4 22.09,36.06 v27.94,41.91
  Top 0.61: U1.16 21.82,63.27 22.86,62.23 J3.1 J3.2 TP15.TESTPOINT
  Bottom 0.305: v27.94,41.91 36.83,41.91 43.18,48.26 43.18,57.15 38.1,62.23 TP15.TESTPOINT
TCK
  Top 0.305: J13.4 7.62,34.98 6.63,35.97 6.63,39.47 8.89,41.73 TP3.TESTPOINT
  Top 0.61: TP3.TESTPOINT J1.5 J1.6 8.89,50.29 12.57,53.97 U1.4
TDO
  Top 0.305: J13.6 8.89,35.38 11.43,37.92 TP4.TESTPOINT
  Top 0.61: TP4.TESTPOINT J1.7 J1.8 11.43,50.8 13.57,52.94 U1.5
TMS
  Top 0.305: J13.2 6.27,34.92 5.84,35.36 3.3,35.36 2.59,35.81 2.59,38.18 6.35,41.94 TP2.TESTPOINT
  Top 0.61: TP2.TESTPOINT J1.3 J1.4 6.35,50.8 7.62,51.82 9.14,51.82 11.57,54.24 U1.3
USB_N
  Top 0.61: TP11.TESTPOINT J3.10 J3.9 27.94,52.07 20.74,59.27 U1.12
USB_P
  Top 0.61: U1.11 20.47,58.27 25.4,53.34 25.4,50.8 26.67,49.53 J3.11 J3.12 TP10.TESTPOINT
VCC(3.3V)  (via drill 0.5 pad 0.61, 1.2)
  Top 0.305: 18.54,33.78 18.55,33.79 U4.P$14 | 20.93,34.52 20.44,34.52 U4.P$1
  Top 0.406: 46.1,68.96 U3.28 | J13.1 6.35,33.02 6.66,32.72 6.66,29.29 7.21,28.73 7.49,28.73 | 7.49,28.73 7.62,28.73 | 7.62,28.73 17.83,28.73 18.31,29.21 C5.1 | 7.47,28.7 7.49,28.73 | 7.62,28.73 7.59,28.7 3.81,28.7 1.4,31.12 1.4,38.99 v2.67,40.26 | C5.1 C4.1 18.54,31.82 18.54,33.78 | C5.1 18.62,28.58 18.9,28.3 22.39,28.3 23.88,29.78 23.88,33.08 22.44,34.52 20.93,34.52 | v2.29,77.22 2.29,75.04 R59.2
  Top 0.61: R6.2 58.42,55.56 C7.1 59.88,53.85 58.93,53.85 v55.88,50.8 | R27.2 R26.2 42.33,54.99 v44.96,54.99 | 46.1,68.96 45.46,68.96 44.96,68.45 v44.96,54.99 | v44.96,54.99 47.43,54.99 C3.1 | U$2.4(OUT) 67.98,56.77 71.12,56.77 72.39,58.04 72.39,62.23 64.77,69.85 59.69,69.85 55.88,73.66 55.88,80.01 v53.34,82.55 | U1.1 8.49,54.61 4.7,54.61 v2.94,52.85 1.4,51.31 1.4,41.53 v2.67,40.26
  Bottom 0.406: v2.94,52.85 2.94,53.02 2.36,53.59 2.36,77.14 v2.29,77.22
  Bottom 0.61: v55.88,50.8 48.26,50.8 | 48.26,50.8 44.96,52.83 v44.96,54.99 | v53.34,82.55 44.45,82.55 36.83,90.17 LED_VCC.1 | LED_VCC.1 34.29,90.17 20.32,90.17 HEJ3.1 HEJ2.1 HEJ1.1 | LED_VCC.1 LED_VCC.2 LED_VCC.3 | 48.26,50.8 37.72,40.26 v2.67,40.26
  Bottom 1.27: U$2.4(OUT) 61.81,56.73 v55.88,50.8
VCC(6V)  (via drill 1.2)
  Top 0.61: R4.2 58.42,40.64 60.01,39.05 C8.1 59.76,38.48 57.4,38.48 55.13,40.75 v55.13,41.49
  Bottom 1.27: U$4.4(OUT) v55.13,41.49 50.38,41.49 48.26,39.37 48.26,35.56 46.99,34.29 SERVO_0.2 SERVO_1.2
VCC_LEDBRKOUT  (via drill 0.5)
  Top 0.254: U2.28 U2.1
  Top 0.406: R28.2 17.78,20.95 19.05,22.23 20.95,22.23 22.86,20.32 v22.86,12.7 21.59,11.43 19.05,11.43 16.51,8.89 16.51,6.35 17.16,5.7 R32.2 | R30.2 109.22,21.59 108.59,22.23 105.41,22.23 104.14,20.95 v104.14,9.54 R34.2 | v101.6,1.52 51.82,1.52 VCC_LEDBRKOUT.2 | VCC_LEDBRKOUT.3 53.02,2.86 C1.1 56.62,2.12 U2.28
  Bottom 0.406: v22.86,12.7 33.66,1.91 45.09,1.91 VCC_LEDBRKOUT.1 VCC_LEDBRKOUT.2 VCC_LEDBRKOUT.3 | v104.14,9.54 104.14,3.43 v101.6,1.52
VCC_LGT1
  Top 0.305: U$15.3 92.59,64.9 86.74,64.9 JP1.1
VCC_LGT2
  Top 0.305: U$16.3 92.97,71.76 92.71,71.25 86.61,71.25 JP2.1
VCC_LGT3
  Top 0.305: U$17.3 92.59,77.6 92.46,77.6 86.61,77.6 JP3.1
VCC_LGT4
  Top 0.305: U$20.3 96.65,66.54 96.65,71.75 JP8.1
VCC_LGT5
  Top 0.305: JP13.1 85.85,59.69 87,58.55 92.46,58.55 93.34,59.44 U$23.3
VCC_LGT6
  Top 0.305: JP14.1 96.65,52.7 96.65,47.24 97.29,46.48 U$24.3
VCC_LGT7
  Top 0.305: JP15.1 86.87,45.85 92.84,45.85 93.35,46.36 U$25.3
VCC_LGT8
  Top 0.305: JP19.1 85.85,53.34 87,52.2 92.84,52.2 93.34,52.7 U$32.3
VDD1
  Top 0.61: U$2.1(EN) 62.94,61.84 C2.1
  Bottom 1.27: U$11.VDD 66.69,92.72 64.52,90.55 64.52,89.92 57.15,82.55 57.15,72.63 U$2.1(EN) U$2.2(IN)
VDD2
  Top 0.61: U$4.1(EN) 65.16,46.6 63.5,48.26 C6.1
  Bottom 1.27: U$14.VDD 66.69,77.36 64.14,74.8 64.14,70.48 72.39,62.23 72.39,51.04 U$4.1(EN) U$4.2(IN)

## Text on the board
tPlace: SDA | SCL | A | SmartBike | Ambe, Hardin, / Kenny, Singh, Zhen | 11/5/2015 | D | I | R | L | A | SCL | SDA | D.A., C.H., / T.K., K.S., / A.Z.